# Altium project Electric Car Project.PrjPcb (part 2 of 2)
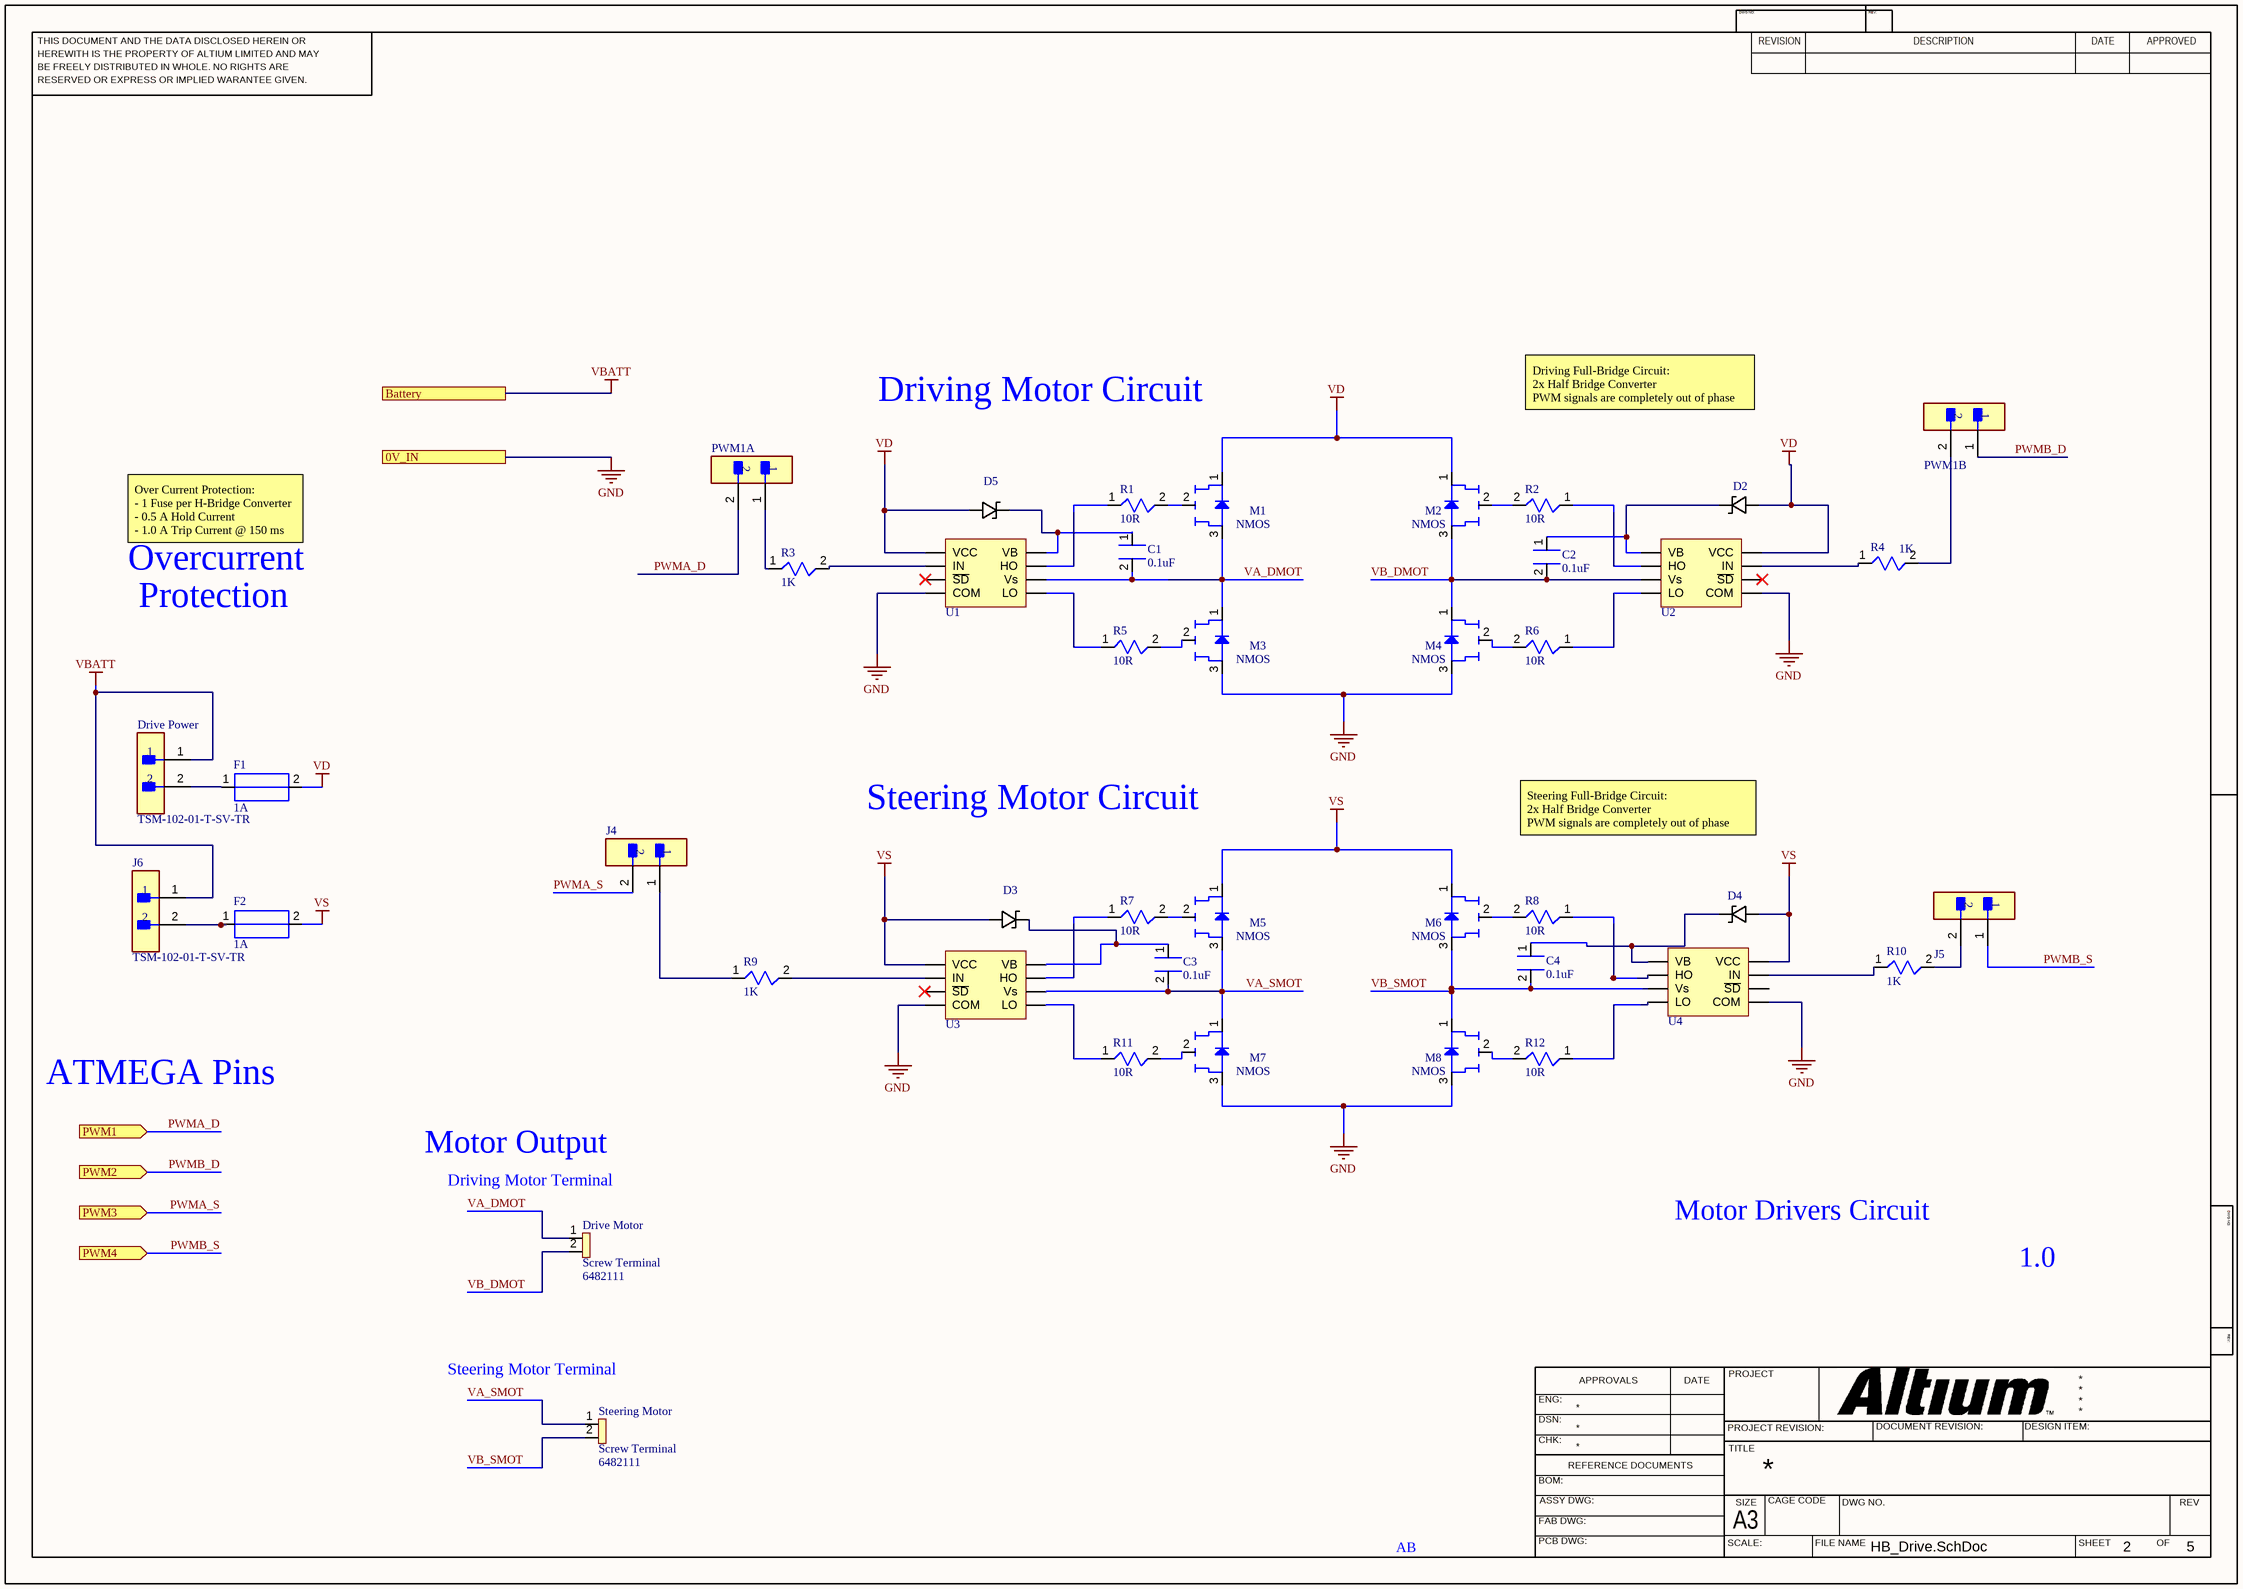
[diagram p5: HB_Drive.SchDoc]

## Nets that join several sheets
+5: Top_Level (PSU_Select.2), MCU (J7.2), Telemetry_MCU (C8.1 U6.3)
+5_USB: Top_Level (PSU_Select.3), Telemetry_MCU (F3.1)
BAT_VOLTAGE: MCU (R37.2), Buck_Converter (Buck_IN.2 C24.2 D7.1 F4.1), HB_Drive (Drive_Power.1 J6.1)
Buck_5V: Top_Level (PSU_Select.1), Buck_Converter (C23.2 U12.7)
GND: MCU (16 pins), Telemetry_MCU (25 pins), Buck_Converter (16 pins), HB_Drive (8 pins)
BUCK_ADC: MCU (R35.2), Buck_Converter (Buck_OUT.1 U12.8)
CS_PWM1B: MCU (U5.14), HB_Drive (PWM1B.1)
MOSI_PWM_2A: MCU (P1.4 U5.15), Buck_Converter (PWM2A.2)
PSU_SELECT: MCU (U5.24), Buck_Converter (R34.2 U12.2)
PWM_1A: MCU (U5.13), HB_Drive (PWM1A.2)
PWM_2A: MCU (U5.10), HB_Drive (J4.2)
PWM_2B: MCU (U5.9), HB_Drive (J5.1)
RESET: MCU (MCU_Reset.4 P1.5 R13.1 U5.29), Telemetry_MCU (MCU1.5)
RXD: MCU (U5.30), Telemetry_MCU (UART_RXD.3)
TXD: MCU (U5.31), Telemetry_MCU (UART_TXD.3)